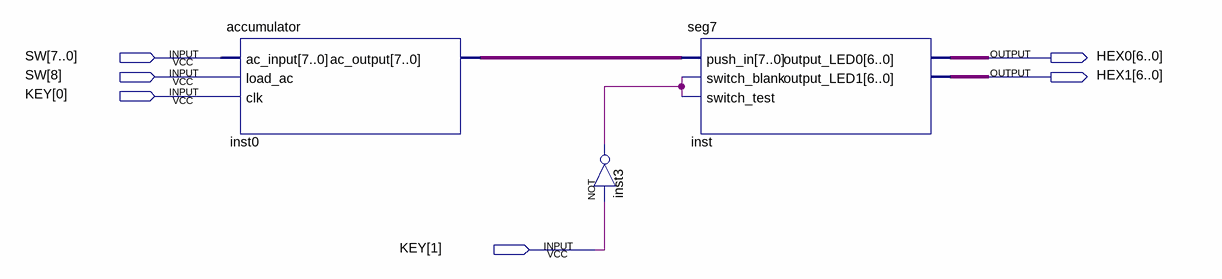
[diagram p0: schematic sheet]
// Quartus schematic ac_tb.bdf as structural Verilog: 3 symbols, 6 pins
module ac_tb (
  input  [8:0] SW,
  input  [1:0] KEY,
  output [6:0] HEX0,
  output [6:0] HEX1
);

  wire inst3_out;
  wire [7:0] inst0_ac_output;

  accumulator inst0 (.ac_input(SW[7:0]), .load_ac(SW[8]), .clk(KEY[0]), .ac_output(inst0_ac_output));
  not inst3 (inst3_out, KEY[1]);
  seg7 inst (
    .push_in(inst0_ac_output), .switch_blank(inst3_out), .switch_test(inst3_out), .output_LED0(HEX0),
    .output_LED1(HEX1));
endmodule
